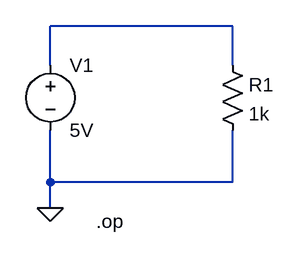
[diagram p0: schematic simple1.asc]
simple1.asc, the LTspice schematic file:
Version 4
SHEET 1 880 680
WIRE 288 208 64 208
WIRE 64 256 64 208
WIRE 288 256 288 208
WIRE 64 400 64 336
WIRE 288 400 288 336
WIRE 288 400 64 400
WIRE 64 432 64 400
FLAG 64 432 0
SYMBOL voltage 64 240 R0
SYMATTR InstName V1
SYMATTR Value 5V
SYMBOL res 272 240 R0
SYMATTR InstName R1
SYMATTR Value 1k
TEXT 120 448 Left 2 !.op

The netlist it stands for:
* simple1.asc
V1 N001 0 5V
R1 N001 0 1k
.op
.backanno
.end